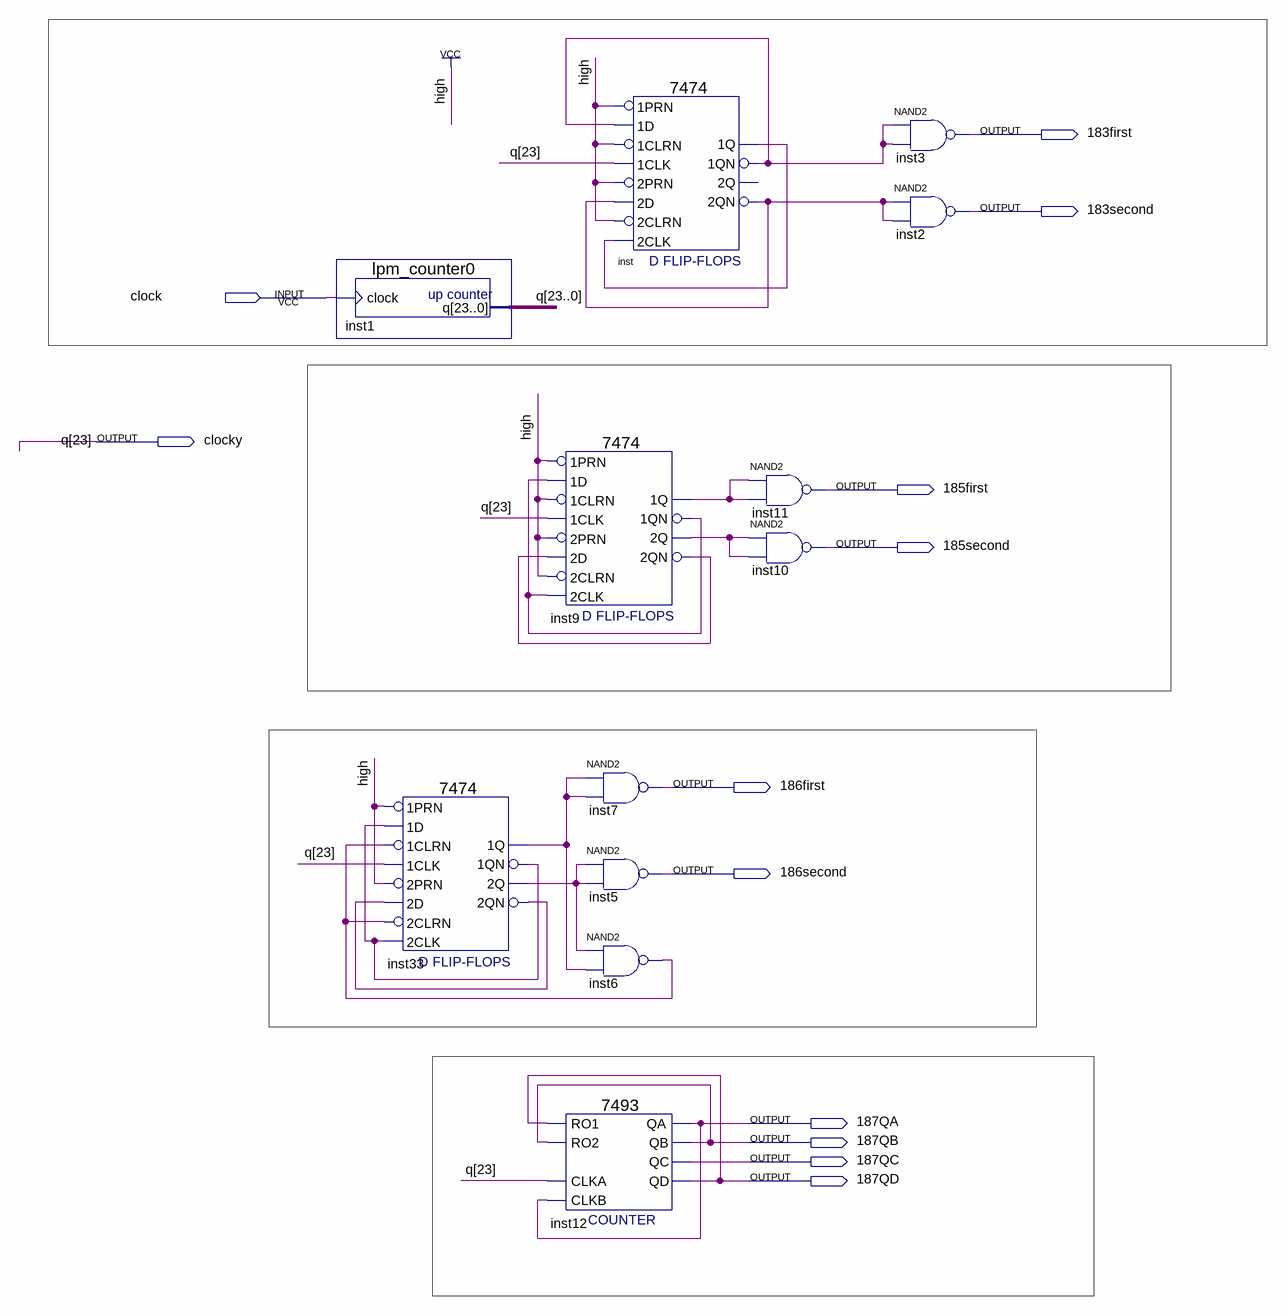
[diagram p0: schematic sheet]
// Quartus schematic Test5.bdf as structural Verilog: 12 symbols, 12 pins
module Test5 (
  input  clock,
  output \183first ,
  output \183second ,
  output clocky,
  output \185first ,
  output \185second ,
  output \186first ,
  output \186second ,
  output \187QA ,
  output \187QB ,
  output \187QC ,
  output \187QD 
);

  wire inst6_out, inst9_1q, inst9_1qn, inst9_2q, inst9_2qn, inst33_1q, inst33_1qn, inst33_2q, inst33_2qn,
       inst_1q, inst_1qn, inst_2qn;
  wire [22:0] q;

  lpm_counter0 inst1 (.clock(clock), .q({clocky, q}));
  \7474  inst33 (
    .\2D (inst33_2qn), .\2PRN (1'b1), .\1CLK (clocky), .\1D (inst33_1qn), .\1PRN (1'b1), .\2CLK (inst33_1qn),
    .\2CLRN (inst6_out), .\1CLRN (inst6_out), .\1QN (inst33_1qn), .\2Q (inst33_2q), .\2QN (inst33_2qn),
    .\1Q (inst33_1q));
  \7474  inst9 (
    .\2D (inst9_2qn), .\2PRN (1'b1), .\1CLK (clocky), .\1D (inst9_1qn), .\1PRN (1'b1), .\2CLK (inst9_1qn),
    .\2CLRN (1'b1), .\1CLRN (1'b1), .\1QN (inst9_1qn), .\2Q (inst9_2q), .\2QN (inst9_2qn), .\1Q (inst9_1q));
  \7493  inst12 (
    .RO1(\187QD ), .RO2(\187QB ), .CLKA(clocky), .CLKB(\187QA ), .QC(\187QC ), .QB(\187QB ), .QA(\187QA ),
    .QD(\187QD ));
  \7474  inst (
    .\2D (inst_2qn), .\2PRN (1'b1), .\1CLK (clocky), .\1D (inst_1qn), .\1PRN (1'b1), .\2CLK (inst_1q),
    .\2CLRN (1'b1), .\1CLRN (1'b1), .\1QN (inst_1qn), .\2QN (inst_2qn), .\1Q (inst_1q));  // open: 2Q
  nand inst7 (\186first , inst33_1q, inst33_1q);
  nand inst5 (\186second , inst33_2q, inst33_2q);
  nand inst6 (inst6_out, inst33_2q, inst33_1q);
  nand inst11 (\185first , inst9_1q, inst9_1q);
  nand inst10 (\185second , inst9_2q, inst9_2q);
  nand inst3 (\183first , inst_1qn, inst_1qn);
  nand inst2 (\183second , inst_2qn, inst_2qn);

  // Other names for the same wires on the sheet: q[23] = clocky
endmodule
